# Altium schematic sheet PDB_schem.SchDoc
size A2; SheetNumber: 1; SheetTotal: 1; SPICEModelCacheNIXBEUAC: <root> / <DocumentId>NIXBEUAC</DocumentId> / </root>
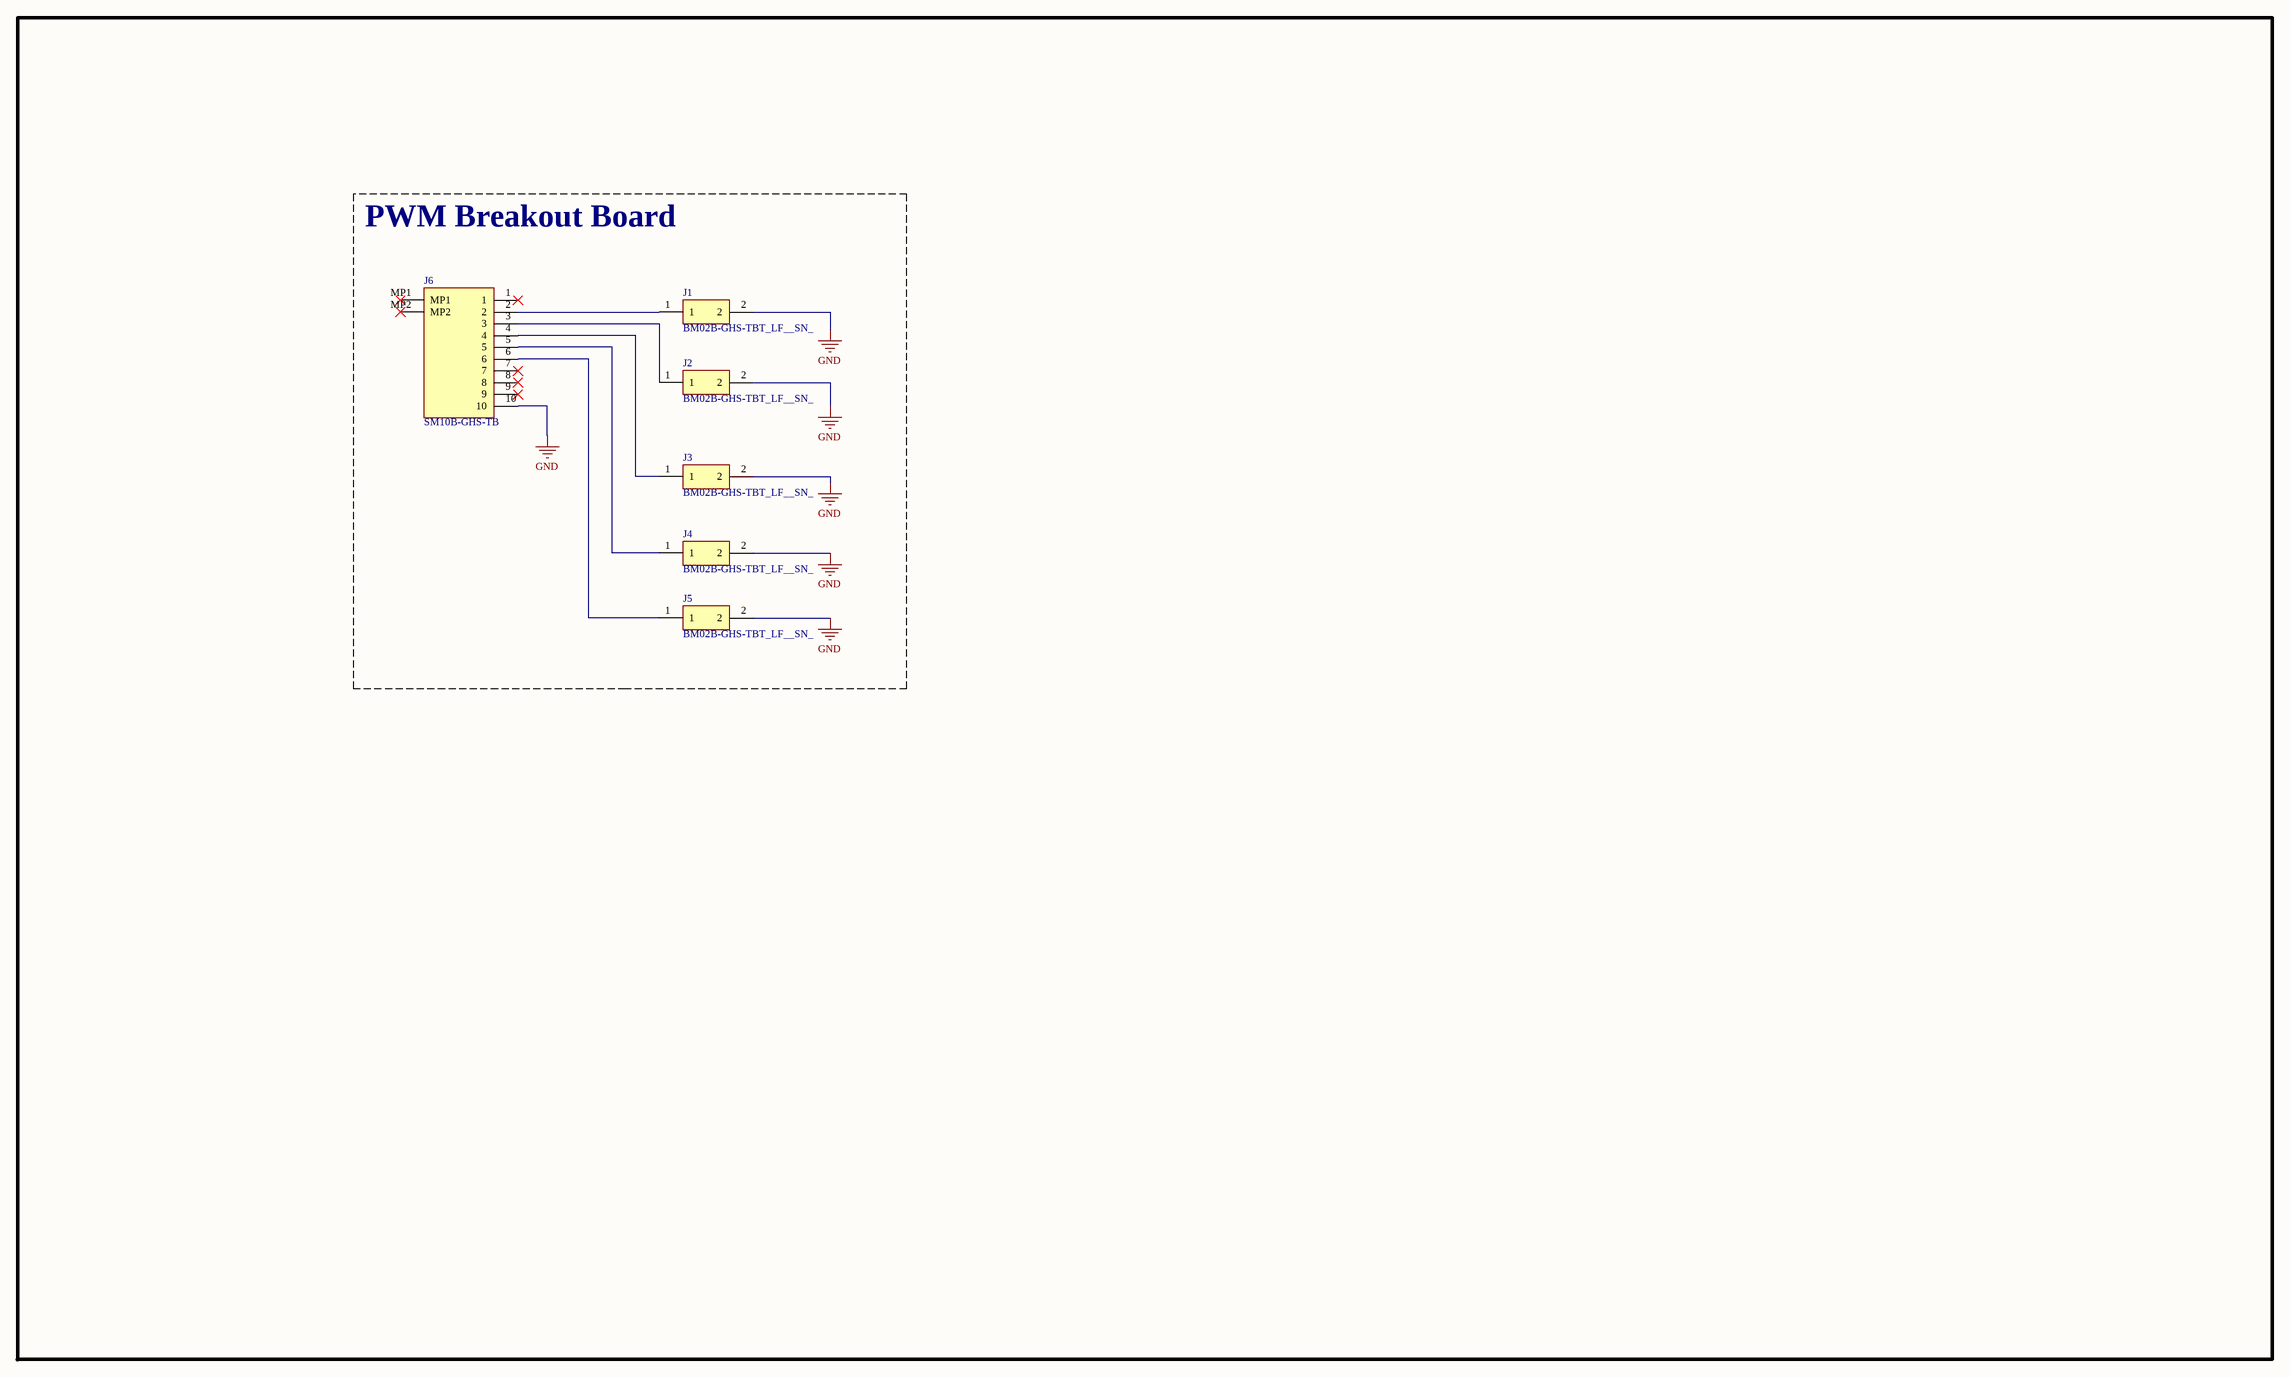
[diagram p0: PDB_schem.SchDoc]

## Parts
J1  BM02B-GHS-TBT_LF__SN_  [BM02B-GHS-TBT_1]
J2  BM02B-GHS-TBT_LF__SN_  [BM02B-GHS-TBT_1]
J3  BM02B-GHS-TBT_LF__SN_  [BM02B-GHS-TBT_1]
J4  BM02B-GHS-TBT_LF__SN_  [BM02B-GHS-TBT_1]
J5  BM02B-GHS-TBT_LF__SN_  [BM02B-GHS-TBT_1]
J6  SM10B-GHS-TB  [SM10BGHSTB]

## Blocks framed on the sheet
PWM Breakout Board: J1-J6

## Nets
GND: J1.2 J2.2 J3.2 J4.2 J5.2 J6.10
NetJ1_1: J1.1 J6.2
NetJ2_1: J2.1 J6.3
NetJ3_1: J3.1 J6.4
NetJ4_1: J4.1 J6.5
NetJ5_1: J5.1 J6.6

Not connected (* = marked no-connect by the designer): J6 1* 7* 8* 9* MP1* MP2*

## Library data of the parts
J1-J5 = BM02B-GHS-TBT_LF__SN__N_: Connector; Manufacturer_Name: JST (JAPAN SOLDERLESS TERMINALS); Manufacturer_Part_Number: BM02B-GHS-TBT(LF)(SN)(N); Datasheet Link: http://www.jst-mfg.com/product/pdf/eng/eGH.pdf; Arrow Part Number: BM02B-GHS-TBT(LF)(SN)(N); Arrow Price/Stock: https://www.arrow.com/en/products/bm02b-ghs-tbt-lf-sn-n/jst-manufacturing?region=nac
J6 = SM10B-GHS-TB: Connector; Manufacturer_Name: 3D SYSTEMS; Datasheet Link: https://4donline.ihs.com/images/VipMasterIC/IC/JSTM/JSTMS02184/JSTMS02184-1.pdf?hkey=EF798316E3902B6ED9A73243A3159BB0; Height: 4.25mm; Manufacturer_Part_Number: SM10B-GHS-TB